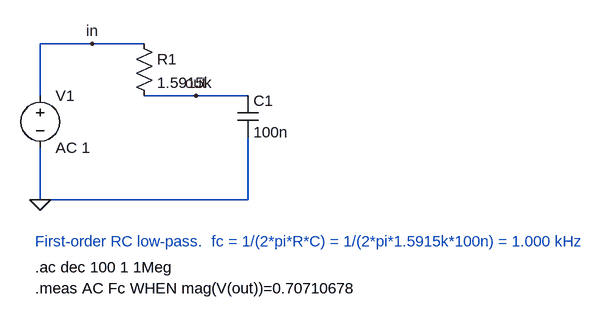
[diagram p0: schematic rc_lowpass.asc]
rc_lowpass.asc, the LTspice schematic file:
Version 4.1
SHEET 1 1064 680
WIRE 176 32 96 32
WIRE 256 32 176 32
WIRE 96 112 96 32
WIRE 336 112 256 112
WIRE 416 112 336 112
WIRE 96 272 96 192
WIRE 416 272 416 176
WIRE 416 272 96 272
FLAG 176 32 in
FLAG 336 112 out
FLAG 96 272 0
SYMBOL voltage 96 96 R0
WINDOW 123 0 0 Left 0
WINDOW 39 0 0 Left 0
SYMATTR InstName V1
SYMATTR Value AC 1
SYMBOL res 240 16 R0
SYMATTR InstName R1
SYMATTR Value 1.5915k
SYMBOL cap 400 112 R0
SYMATTR InstName C1
SYMATTR Value 100n
TEXT 88 336 Left 2 ;First-order RC low-pass.  fc = 1/(2*pi*R*C) = 1/(2*pi*1.5915k*100n) = 1.000 kHz
TEXT 88 376 Left 2 !.ac dec 100 1 1Meg
TEXT 88 408 Left 2 !.meas AC Fc WHEN mag(V(out))=0.70710678

The netlist it stands for:
* rc_lowpass.asc
V1 in 0 AC 1
R1 in out 1.5915k
C1 out 0 100n
* First-order RC low-pass.  fc = 1/(2*pi*R*C) = 1/(2*pi*1.5915k*100n) = 1.000 kHz
.ac dec 100 1 1Meg
.meas AC Fc WHEN mag(V(out))=0.70710678
.backanno
.end